# Altium schematic sheet GC-Sch2.SchDoc (part 2 of 3)
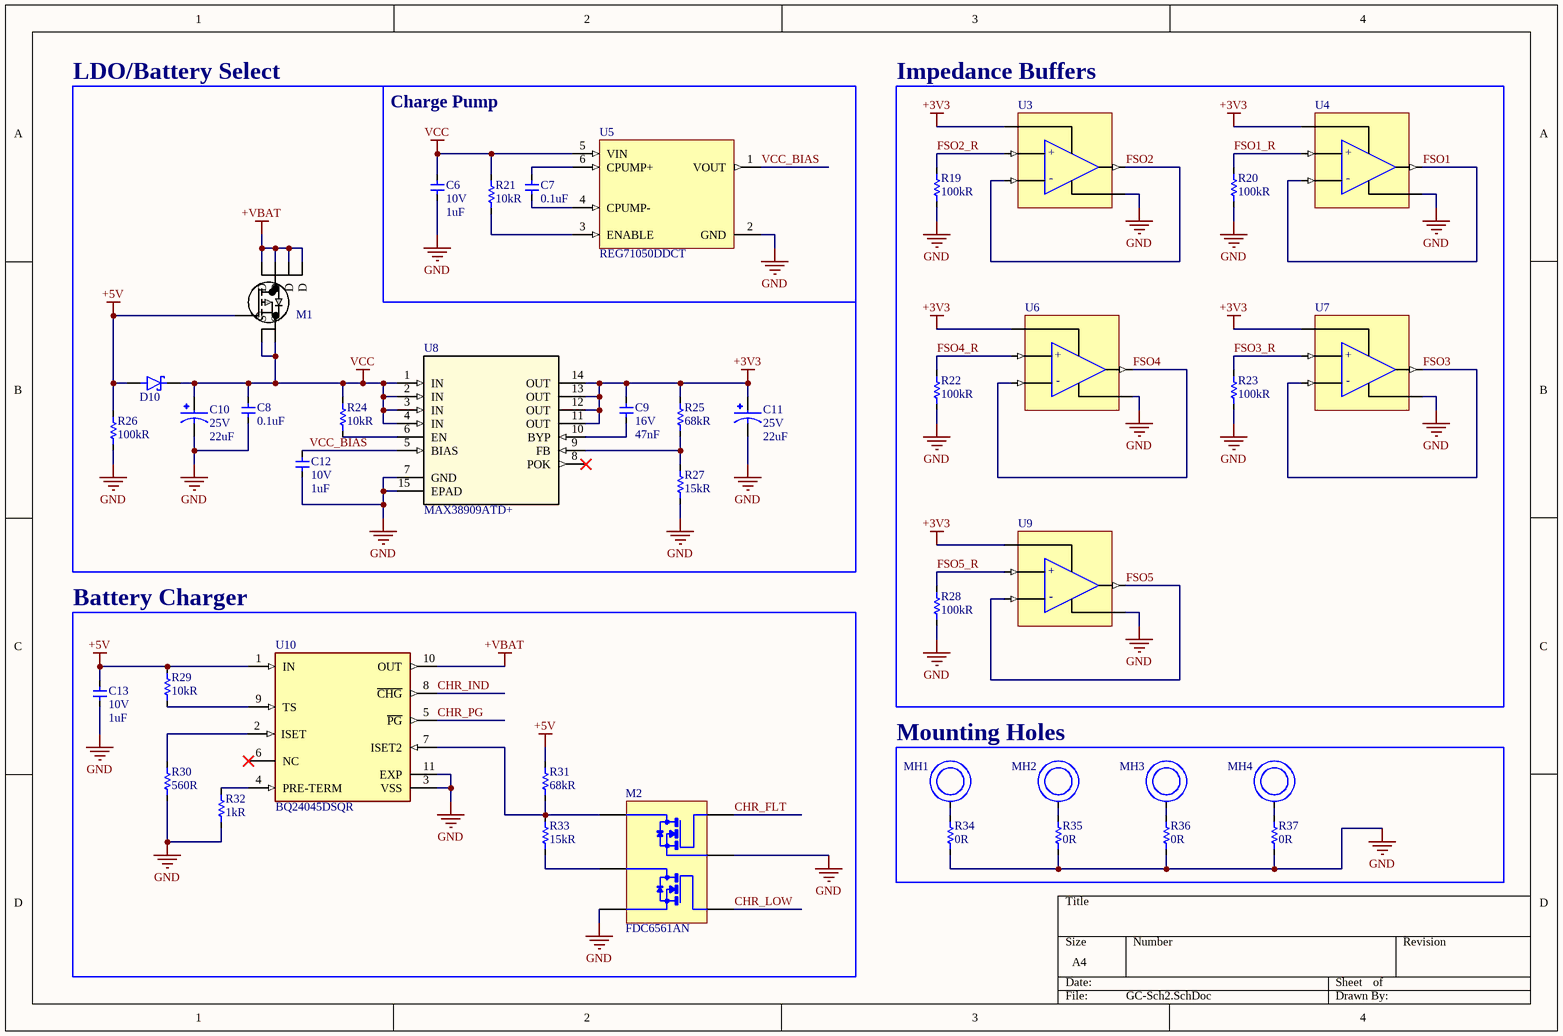
[diagram p1: GC-Sch2.SchDoc]
## Library data of the parts
C6 C13 = CC-CL10B105KP8NNNC: Ceramic Capacitor, Multilayer, Ceramic, 10V, 10% +Tol, 10% -Tol, X7R, 15% TC, 1uF, Surface Mount, 0603; Manufacturer: Samsung; Multilayer: Yes; Supplier 1: Avnet; Supplier Part Number 1: CL10B105KP8NNNC; Manufacturer Part Number: CL10B105KP8NNNC; RoHS: Yes; Category: Ceramic Capacitors; Stock: 168000; Pricing: 4000=0.00532, 8000=0.0052, 16000=0.00508, 24000=0.00496, 32000=0.00484 (USD); Mount: Surface Mount; Number of Pins: 2; Dielectric Material: Ceramic; Package Shape: Rectangular; Size Code: 0603; Terminal Finish: Nickel; Min Operating Temperature: -55°C; Max Operating Temperature: 125°C; Termination: Wraparound; JESD-609 Code: e3; Capacitor Type: Ceramic; Negative Tolerance: 10%; Package Style: SMTMeter; Packaging: Tape and Reel; Positive Tolerance: 10%; Temperature Characteristics Code: X7R; Length: 1.6mm; Width: 0.8mm; Height: 0.9mm; Reach SVHC Compliant: Yes; RoHS Compliant: Yes; ComponentLink1URL: https://datasheet.ciiva.com:443/pdfs/VipMasterIC/IC/SEMS/SEMS-S-A0008526420/SEMS-S-A0008526450-1.pdf?src-supplier=IHS+Markit; ComponentLink1Description: https://datasheet.ciiva.com:443/pdfs/VipMasterIC/IC/SEMS/SEMS-S-A0008526420/SEMS-S-A0008526450-1.pdf?src-supplier=IHS+Markit; ComponentLink2URL: https://datasheet.ciiva.com/25788/cl10b105kp8nnnc-25788304.pdf?src-supplier=Digikey; ComponentLink2Description: https://datasheet.ciiva.com/25788/cl10b105kp8nnnc-25788304.pdf?src-supplier=Digikey; ComponentLink3URL: https://datasheet.ciiva.com/16396/cl10b105kp8nnnc-16396970.pdf?src-supplier=Future+Electronics; ComponentLink3Description: https://datasheet.ciiva.com/16396/cl10b105kp8nnnc-16396970.pdf?src-supplier=Future+Electronics; ComponentLink4URL: https://datasheet.ciiva.com/26838/getdatasheetpartid-358410-26838426.pdf?src-supplier=Verical; ComponentLink4Description: https://datasheet.ciiva.com/26838/getdatasheetpartid-358410-26838426.pdf?src-supplier=Verical
C7 = CC-CL10B104JB8NNNC: Ceramic Capacitor, Multilayer, Ceramic, 50V, 5% +Tol, 5% -Tol, X7R, 15% TC, 0.1uF, Surface Mount, 0603; Manufacturer: Samsung; Multilayer: Yes; Supplier 1: Avnet; Supplier Part Number 1: CL10B104JB8NNNC; Manufacturer Part Number: CL10B104JB8NNNC; RoHS: Yes; Category: Ceramic Capacitors; Stock: 4000; Pricing: 4000=0.00545, 8000=0.00532, 16000=0.0052, 24000=0.00507, 32000=0.00495 (USD); Mount: Surface Mount; Number of Pins: 2; Dielectric Material: Ceramic; Package Shape: Rectangular; Size Code: 0603; Terminal Finish: Nickel; Min Operating Temperature: -55°C; Max Operating Temperature: 125°C; JESD-609 Code: e3; Capacitor Type: Ceramic; Negative Tolerance: 5%; Package Style: SMTMeter; Packaging: Tape and Reel; Positive Tolerance: 5%; Rated DC Voltage (URdc): 50V; Temperature Characteristics Code: X7R; Termination: Wraparound; Length: 1.6mm; Width: 0.8mm; Height: 0.8mm; Reach SVHC Compliant: Yes; RoHS Compliant: Yes; ComponentLink1URL: https://datasheet.ciiva.com:443/pdfs/VipMasterIC/IC/SEMS/SEMS-S-A0008384515/SEMS-S-A0008873313-1.pdf?src-supplier=IHS+Markit; ComponentLink1Description: https://datasheet.ciiva.com:443/pdfs/VipMasterIC/IC/SEMS/SEMS-S-A0008384515/SEMS-S-A0008873313-1.pdf?src-supplier=IHS+Markit; ComponentLink2URL: https://datasheet.ciiva.com/16498/cl10b104jb8nnnc-16498485.pdf?src-supplier=Future+Electronics; ComponentLink2Description: https://datasheet.ciiva.com/16498/cl10b104jb8nnnc-16498485.pdf?src-supplier=Future+Electronics; ComponentLink3URL: https://datasheet.ciiva.com/26838/getdatasheetpartid-359321-26838402.pdf?src-supplier=Verical; ComponentLink3Description: https://datasheet.ciiva.com/26838/getdatasheetpartid-359321-26838402.pdf?src-supplier=Verical; ComponentLink4URL: https://datasheet.ciiva.com/25793/cl10b104jb8nnnc-25793394.pdf?src-supplier=Digikey; ComponentLink4Description: https://datasheet.ciiva.com/25793/cl10b104jb8nnnc-25793394.pdf?src-supplier=Digikey; ComponentLink5URL: https://datasheet.ciiva.com/29199/456613-da-01-en-vs-kondensator-0603-29199008.pdf?src-supplier=Conrad; ComponentLink5Description: https://datasheet.ciiva.com/29199/456613-da-01-en-vs-kondensator-0603-29199008.pdf?src-supplier=Conrad
C8 = C-CL10B104JB8NNNC: Ceramic Capacitor, Multilayer, Ceramic, 50V, 5% +Tol, 5% -Tol, X7R, 15% TC, 0.1uF, Surface Mount, 0603; Manufacturer: Samsung; Multilayer: Yes; Supplier 1: Avnet; Supplier Part Number 1: CL10B104JB8NNNC; Manufacturer Part Number: CL10B104JB8NNNC; RoHS: Yes; Category: Ceramic Capacitors; Stock: 4000; Pricing: 4000=0.00545, 8000=0.00532, 16000=0.0052, 24000=0.00507, 32000=0.00495 (USD); Mount: Surface Mount; Number of Pins: 2; Dielectric Material: Ceramic; Package Shape: Rectangular; Size Code: 0603; Terminal Finish: Nickel; Min Operating Temperature: -55°C; Max Operating Temperature: 125°C; JESD-609 Code: e3; Capacitor Type: Ceramic; Negative Tolerance: 5%; Package Style: SMTMeter; Packaging: Tape and Reel; Positive Tolerance: 5%; Rated DC Voltage (URdc): 50V; Temperature Characteristics Code: X7R; Termination: Wraparound; Length: 1.6mm; Width: 0.8mm; Height: 0.8mm; Reach SVHC Compliant: Yes; RoHS Compliant: Yes; ComponentLink1URL: https://datasheet.ciiva.com:443/pdfs/VipMasterIC/IC/SEMS/SEMS-S-A0008384515/SEMS-S-A0008873313-1.pdf?src-supplier=IHS+Markit; ComponentLink1Description: https://datasheet.ciiva.com:443/pdfs/VipMasterIC/IC/SEMS/SEMS-S-A0008384515/SEMS-S-A0008873313-1.pdf?src-supplier=IHS+Markit; ComponentLink2URL: https://datasheet.ciiva.com/16498/cl10b104jb8nnnc-16498485.pdf?src-supplier=Future+Electronics; ComponentLink2Description: https://datasheet.ciiva.com/16498/cl10b104jb8nnnc-16498485.pdf?src-supplier=Future+Electronics; ComponentLink3URL: https://datasheet.ciiva.com/26838/getdatasheetpartid-359321-26838402.pdf?src-supplier=Verical; ComponentLink3Description: https://datasheet.ciiva.com/26838/getdatasheetpartid-359321-26838402.pdf?src-supplier=Verical; ComponentLink4URL: https://datasheet.ciiva.com/25793/cl10b104jb8nnnc-25793394.pdf?src-supplier=Digikey; ComponentLink4Description: https://datasheet.ciiva.com/25793/cl10b104jb8nnnc-25793394.pdf?src-supplier=Digikey; ComponentLink5URL: https://datasheet.ciiva.com/29199/456613-da-01-en-vs-kondensator-0603-29199008.pdf?src-supplier=Conrad; ComponentLink5Description: https://datasheet.ciiva.com/29199/456613-da-01-en-vs-kondensator-0603-29199008.pdf?src-supplier=Conrad
C9 = CC-CL10B473KO8NNNC: Ceramic Capacitor, Multilayer, Ceramic, 16V, 10% +Tol, 10% -Tol, X7R, 15% TC, 0.047uF, Surface Mount, 0603; Manufacturer: Samsung; Multilayer: Yes; Supplier 1: Avnet; Supplier Part Number 1: CL10B473KO8NNNC; Manufacturer Part Number: CL10B473KO8NNNC; RoHS: Yes; Category: Ceramic Capacitors; Stock: 4000; Pricing: 4000=0.00536, 8000=0.00524, 16000=0.00511, 24000=0.00499, 32000=0.00487 (USD); Mount: Surface Mount; Number of Pins: 2; Dielectric Material: Ceramic; Package Shape: Rectangular; Size Code: 0603; Terminal Finish: Nickel; Min Operating Temperature: -55°C; Max Operating Temperature: 125°C; JESD-609 Code: e3; Capacitor Type: Ceramic; Negative Tolerance: 10%; Packaging: Tape and Reel; Positive Tolerance: 10%; Temperature Characteristics Code: X7R; Termination: Wraparound; Package Style: SMTMeter; Length: 1.6mm; Width: 0.8mm; Height: 0.8mm; Reach SVHC Compliant: Yes; RoHS Compliant: Yes; ComponentLink1URL: https://datasheet.ciiva.com:443/pdfs/VipMasterIC/IC/SEMS/SEMS-S-A0008521219/SEMS-S-A0008521235-1.pdf?src-supplier=IHS+Markit; ComponentLink1Description: https://datasheet.ciiva.com:443/pdfs/VipMasterIC/IC/SEMS/SEMS-S-A0008521219/SEMS-S-A0008521235-1.pdf?src-supplier=IHS+Markit; ComponentLink2URL: https://datasheet.ciiva.com/15195/getdatasheetpartid-354053-15195766.pdf?src-supplier=Verical; ComponentLink2Description: https://datasheet.ciiva.com/15195/getdatasheetpartid-354053-15195766.pdf?src-supplier=Verical
C10 = C-EEE-FP1E220AR: Aluminum Electrolytic Capacitor, Polarized, Aluminum (wet), 25V, 20% +Tol, 20% -Tol, 22uF, Surface Mount, 2121; Manufacturer: Panasonic; Manufacturer Series: FP; Dielectric Material: Aluminium; ESR (Equivalent Series Resistance): 360mR; Leakage Current: 5.5uA; Ripple Current: 240mA; Tan Delta: 0.14; Supplier 1: Mouser; Supplier Part Number 1: 667-EEE-FP1E220AR; Manufacturer Part Number: EEE-FP1E220AR; RoHS: Yes; Category: Aluminum Electrolytic Capacitors; Stock: 28900; Pricing: 1=0.5, 10=0.271, 50=0.271, 100=0.175, 1000=0.134, 10000=0.114 (USD); Mount: Surface Mount; Number of Pins: 2; Package Shape: Cylindrical; Size Code: 2121; Terminal Finish: Tin; Min Operating Temperature: -55°C; Max Operating Temperature: 105°C; JESD-609 Code: e3,e6; Polarity: Polarized; Capacitor Type: Aluminium; Negative Tolerance: 20%; Package Style: SMTMeter; Packaging: Tape and Reel; Positive Tolerance: 20%; Series: EEE-FP(LF REFLOW); Termination: Flat; Length: 6.5mm; Width: 5.3mm; Height: 5.8mm; Reach SVHC Compliant: Yes; RoHS Compliant: Yes; ComponentLink1URL: https://datasheet.ciiva.com:443/pdfs/VipMasterIC/IC/PANA/PANA-S-A0009615249/PANA-S-A0009615249-1.pdf?src-supplier=IHS+Markit; ComponentLink1Description: https://datasheet.ciiva.com:443/pdfs/VipMasterIC/IC/PANA/PANA-S-A0009615249/PANA-S-A0009615249-1.pdf?src-supplier=IHS+Markit; ComponentLink2URL: https://datasheet.ciiva.com/48523/fp-eng-tds-48523749.pdf?src-supplier=Distrelec; ComponentLink2Description: https://datasheet.ciiva.com/48523/fp-eng-tds-48523749.pdf?src-supplier=Distrelec; ComponentLink3URL: https://datasheet.ciiva.com/16390/aba0000ce114-16390486.pdf?src-supplier=Future+Electronics; ComponentLink3Description: https://datasheet.ciiva.com/16390/aba0000ce114-16390486.pdf?src-supplier=Future+Electronics; ComponentLink4URL: https://datasheet.ciiva.com/15166/getdatasheetpartid-178535-15166251.pdf?src-supplier=Verical; ComponentLink4Description: https://datasheet.ciiva.com/15166/getdatasheetpartid-178535-15166251.pdf?src-supplier=Verical
C11 = CC-EEE-FP1E220AR: Aluminum Electrolytic Capacitor, Polarized, Aluminum (wet), 25V, 20% +Tol, 20% -Tol, 22uF, Surface Mount, 2121; Manufacturer: Panasonic; Manufacturer Series: FP; Dielectric Material: Aluminium; ESR (Equivalent Series Resistance): 360mR; Leakage Current: 5.5uA; Ripple Current: 240mA; Tan Delta: 0.14; Supplier 1: Mouser; Supplier Part Number 1: 667-EEE-FP1E220AR; Manufacturer Part Number: EEE-FP1E220AR; RoHS: Yes; Category: Aluminum Electrolytic Capacitors; Stock: 28900; Pricing: 1=0.5, 10=0.271, 50=0.271, 100=0.175, 1000=0.134, 10000=0.114 (USD); Mount: Surface Mount; Number of Pins: 2; Package Shape: Cylindrical; Size Code: 2121; Terminal Finish: Tin; Min Operating Temperature: -55°C; Max Operating Temperature: 105°C; JESD-609 Code: e3,e6; Polarity: Polarized; Capacitor Type: Aluminium; Negative Tolerance: 20%; Package Style: SMTMeter; Packaging: Tape and Reel; Positive Tolerance: 20%; Series: EEE-FP(LF REFLOW); Termination: Flat; Length: 6.5mm; Width: 5.3mm; Height: 5.8mm; Reach SVHC Compliant: Yes; RoHS Compliant: Yes; ComponentLink1URL: https://datasheet.ciiva.com:443/pdfs/VipMasterIC/IC/PANA/PANA-S-A0009615249/PANA-S-A0009615249-1.pdf?src-supplier=IHS+Markit; ComponentLink1Description: https://datasheet.ciiva.com:443/pdfs/VipMasterIC/IC/PANA/PANA-S-A0009615249/PANA-S-A0009615249-1.pdf?src-supplier=IHS+Markit; ComponentLink2URL: https://datasheet.ciiva.com/48523/fp-eng-tds-48523749.pdf?src-supplier=Distrelec; ComponentLink2Description: https://datasheet.ciiva.com/48523/fp-eng-tds-48523749.pdf?src-supplier=Distrelec; ComponentLink3URL: https://datasheet.ciiva.com/16390/aba0000ce114-16390486.pdf?src-supplier=Future+Electronics; ComponentLink3Description: https://datasheet.ciiva.com/16390/aba0000ce114-16390486.pdf?src-supplier=Future+Electronics; ComponentLink4URL: https://datasheet.ciiva.com/15166/getdatasheetpartid-178535-15166251.pdf?src-supplier=Verical; ComponentLink4Description: https://datasheet.ciiva.com/15166/getdatasheetpartid-178535-15166251.pdf?src-supplier=Verical
C12 = C-CL10B105KP8NNNC: Ceramic Capacitor, Multilayer, Ceramic, 10V, 10% +Tol, 10% -Tol, X7R, 15% TC, 1uF, Surface Mount, 0603; Manufacturer: Samsung; Multilayer: Yes; Supplier 1: Avnet; Supplier Part Number 1: CL10B105KP8NNNC; Manufacturer Part Number: CL10B105KP8NNNC; RoHS: Yes; Category: Ceramic Capacitors; Stock: 168000; Pricing: 4000=0.00532, 8000=0.0052, 16000=0.00508, 24000=0.00496, 32000=0.00484 (USD); Mount: Surface Mount; Number of Pins: 2; Dielectric Material: Ceramic; Package Shape: Rectangular; Size Code: 0603; Terminal Finish: Nickel; Min Operating Temperature: -55°C; Max Operating Temperature: 125°C; Termination: Wraparound; JESD-609 Code: e3; Capacitor Type: Ceramic; Negative Tolerance: 10%; Package Style: SMTMeter; Packaging: Tape and Reel; Positive Tolerance: 10%; Temperature Characteristics Code: X7R; Length: 1.6mm; Width: 0.8mm; Height: 0.9mm; Reach SVHC Compliant: Yes; RoHS Compliant: Yes; ComponentLink1URL: https://datasheet.ciiva.com:443/pdfs/VipMasterIC/IC/SEMS/SEMS-S-A0008526420/SEMS-S-A0008526450-1.pdf?src-supplier=IHS+Markit; ComponentLink1Description: https://datasheet.ciiva.com:443/pdfs/VipMasterIC/IC/SEMS/SEMS-S-A0008526420/SEMS-S-A0008526450-1.pdf?src-supplier=IHS+Markit; ComponentLink2URL: https://datasheet.ciiva.com/25788/cl10b105kp8nnnc-25788304.pdf?src-supplier=Digikey; ComponentLink2Description: https://datasheet.ciiva.com/25788/cl10b105kp8nnnc-25788304.pdf?src-supplier=Digikey; ComponentLink3URL: https://datasheet.ciiva.com/16396/cl10b105kp8nnnc-16396970.pdf?src-supplier=Future+Electronics; ComponentLink3Description: https://datasheet.ciiva.com/16396/cl10b105kp8nnnc-16396970.pdf?src-supplier=Future+Electronics; ComponentLink4URL: https://datasheet.ciiva.com/26838/getdatasheetpartid-358410-26838426.pdf?src-supplier=Verical; ComponentLink4Description: https://datasheet.ciiva.com/26838/getdatasheetpartid-358410-26838426.pdf?src-supplier=Verical
D10 = D-BAT760-7: Rectifier Diode, Schottky, 1 Phase, 1 Element, 1A, 30V V(RRM), Silicon; Manufacturer: Diodes; Package Body Material: Plastic; Additional Feature: HIGH RELIABILITY; Forward Voltage-Max (VF): 270mV; Non-rep Pk Forward Current-Max: 5.5A; Number of Elements: 1; Max Power Dissipation: 235mW; Time @ Peak Reflow Temperature-Max (s): 40s; Qualification Status: Not Qualified; Supplier 1: Future Electronics; Supplier Part Number 1: 4017860; Manufacturer Part Number: BAT760-7; RoHS: Yes; Category: Rectifier Diodes; Stock: 81000; Pricing: 3000=0.0527, 9000=0.0507, 15000=0.0498, 45000=0.048, 75000=0.0464 (USD); Number of Pins: 2; Package Shape: Rectangular; Diode Element Material: SILICON; Terminal Finish: Tin; Min Operating Temperature: -65°C; Max Operating Temperature: 125°C; JESD-30 Code: R-PDSO-G2; Package Style: SMALL OUTLINEMeter; Surface Mount: Yes; Technology: SCHOTTKY; Terminal Form: Gull Wing; Terminal Position: DUAL; JESD-609 Code: e3; Diode Type: RECTIFIER; Moisture Sensitivity Level: 1; Max Output Current: 1A; Peak Reflow Temperature (Cel): 260°C; Rep Pk Reverse Voltage-Max: 30V; Reach SVHC Compliant: Yes; RoHS Compliant: Yes; ComponentLink1URL: https://datasheet.ciiva.com:443/pdfs/VipMasterIC/IC/DIOD/DIOD-S-A0004140720/DIOD-S-A0004140720-1.pdf?src-supplier=IHS+Markit; ComponentLink1Description: https://datasheet.ciiva.com:443/pdfs/VipMasterIC/IC/DIOD/DIOD-S-A0004140720/DIOD-S-A0004140720-1.pdf?src-supplier=IHS+Markit; ComponentLink2URL: https://datasheet.ciiva.com/1178/ds30498-1178033.pdf?src-supplier=Element14; ComponentLink2Description: https://datasheet.ciiva.com/1178/ds30498-1178033.pdf?src-supplier=Element14; ComponentLink3URL: https://datasheet.ciiva.com/4715/ds30498-63155-4715521.pdf?src-supplier=Mouser; ComponentLink3Description: https://datasheet.ciiva.com/4715/ds30498-63155-4715521.pdf?src-supplier=Mouser; ComponentLink4URL: https://datasheet.ciiva.com/8301/ds30498-8301400.pdf?src-supplier=Avnet; ComponentLink4Description: https://datasheet.ciiva.com/8301/ds30498-8301400.pdf?src-supplier=Avnet; ComponentLink5URL: https://datasheet.ciiva.com/22695/1670989-22695799.pdf?src-supplier=Element14; ComponentLink5Description: https://datasheet.ciiva.com/22695/1670989-22695799.pdf?src-supplier=Element14; ComponentLink6URL: https://datasheet.ciiva.com/914/ds30498-914552.pdf?src-supplier=Digikey; ComponentLink6Description: https://datasheet.ciiva.com/914/ds30498-914552.pdf?src-supplier=Digikey; ComponentLink7URL: https://datasheet.ciiva.com/914/ds30498-914553.pdf?src-supplier=Digikey; ComponentLink7Description: https://datasheet.ciiva.com/914/ds30498-914553.pdf?src-supplier=Digikey; ComponentLink8URL: https://datasheet.ciiva.com/914/ds30498-914551.pdf?src-supplier=Digikey; ComponentLink8Description: https://datasheet.ciiva.com/914/ds30498-914551.pdf?src-supplier=Digikey
M1 = M-SIA427ADJ-T1-GE3: Power Field-Effect Transistor, 12A I(D), 8V, 0.016ohm, 1-Element, P-Channel, Silicon, Metal-oxide Semiconductor FET; Manufacturer: Vishay Siliconix; Power Dissipation-Max (Abs): 19W; Supplier 1: Mouser; Supplier Part Number 1: 78-SIA427ADJ-T1-GE3; Manufacturer Part Number: SIA427ADJ-T1-GE3; RoHS: Yes; Category: MOSFETs; Stock: 63429; Pricing: 1=0.53, 10=0.455, 50=0.455, 100=0.34, 1000=0.207, 10000=0.158 (USD); Terminal Finish: Tin; Max Operating Temperature: 150°C; JESD-609 Code: e3; Polarity/Channel Type: P-CHANNEL; Drain Current-Max (Abs) (ID): 12A; FET Technology: METAL-OXIDE SEMICONDUCTOR; Surface Mount: Yes; Reach SVHC Compliant: Yes; RoHS Compliant: Yes; ComponentLink1URL: https://datasheet.ciiva.com:443/pdfs/VipMasterIC/IC/VISH/VISH-S-A0001142626/VISH-S-A0001142626-1.pdf?src-supplier=IHS+Markit; ComponentLink1Description: https://datasheet.ciiva.com:443/pdfs/VipMasterIC/IC/VISH/VISH-S-A0001142626/VISH-S-A0001142626-1.pdf?src-supplier=IHS+Markit; ComponentLink2URL: http://www.farnell.com/datasheets/2614535.pdf?src-supplier=Farnell; ComponentLink2Description: http://www.farnell.com/datasheets/2614535.pdf?src-supplier=Farnell; ComponentLink3URL: http://www.mouser.com/ds/2/427/sia427adj-537173.pdf?src-supplier=Mouser; ComponentLink3Description: http://www.mouser.com/ds/2/427/sia427adj-537173.pdf?src-supplier=Mouser; ComponentLink4URL: http://www.vishay.com/docs/63651/sia427adj.pdf?src-supplier=Digikey; ComponentLink4Description: http://www.vishay.com/docs/63651/sia427adj.pdf?src-supplier=Digikey; ComponentLink5URL: http://www.vishay.com/docs/63651/sia427adj.pdf?src-supplier=Avnet; ComponentLink5Description: http://www.vishay.com/docs/63651/sia427adj.pdf?src-supplier=Avnet; ComponentLink6URL: http://www.farnell.com/datasheets/2614535.pdf?src-supplier=Element14; ComponentLink6Description: http://www.farnell.com/datasheets/2614535.pdf?src-supplier=Element14; ComponentLink7URL: http://www.farnell.com/datasheets/2614535.pdf?src-supplier=Newark; ComponentLink7Description: http://www.farnell.com/datasheets/2614535.pdf?src-supplier=Newark
M2 = M-FDC6561AN: Small Signal Field-Effect Transistor, 2.5A I(D), 30V, 2-Element, N-Channel, Silicon, Metal-oxide Semiconductor FET; Manufacturer: ON Semiconductor / Fairchild; Package Body Material: Plastic; Drain-source On Resistance-Max: 95mR; Number of Elements: 2; Operating Mode: ENHANCEMENT MODE; Power Dissipation-Max (Abs): 960mW; Transistor Application: SWITCHING; Qualification Status: Not Qualified; Supplier 1: Future Electronics; Supplier Part Number 1: 1119379; Manufacturer Part Number: FDC6561AN; RoHS: Yes; Category: MOSFETs; Stock: 60000; Pricing: 3000=0.215, 6000=0.21, 9000=0.205, 12000=0.205, 15000=0.2 (USD); Number of Pins: 6; Package Shape: Rectangular; Transistor Element Material: SILICON; Max Operating Temperature: 150°C; Package Style: SMALL OUTLINEMeter; Surface Mount: Yes; Polarity/Channel Type: N-CHANNEL; Drain Current-Max (ID): 2.5A; DS Breakdown Voltage-Min: 30V; FET Technology: METAL-OXIDE SEMICONDUCTOR; JESD-30 Code: R-PDSO-G6; Moisture Sensitivity Level: 1; Terminal Form: Gull Wing; Terminal Position: DUAL; Drain Current-Max (Abs) (ID): 2.5A; Reach SVHC Compliant: Yes; RoHS Compliant: Yes; ComponentLink1URL: https://datasheet.ciiva.com:443/pdfs/VipMasterIC/IC/ONSM/ONSM-S-A0003579719/ONSM-S-A0003579719-1.pdf?src-supplier=IHS+Markit; ComponentLink1Description: https://datasheet.ciiva.com:443/pdfs/VipMasterIC/IC/ONSM/ONSM-S-A0003579719/ONSM-S-A0003579719-1.pdf?src-supplier=IHS+Markit; ComponentLink2URL: https://datasheet.ciiva.com/1252/11844-1252600.pdf?src-supplier=Newark; ComponentLink2Description: https://datasheet.ciiva.com/1252/11844-1252600.pdf?src-supplier=Newark; ComponentLink3URL: https://datasheet.ciiva.com/928/fdc6561an-928038.pdf?src-supplier=Digikey; ComponentLink3Description: https://datasheet.ciiva.com/928/fdc6561an-928038.pdf?src-supplier=Digikey; ComponentLink4URL: https://datasheet.ciiva.com/928/fdc6561an-928039.pdf?src-supplier=Digikey; ComponentLink4Description: https://datasheet.ciiva.com/928/fdc6561an-928039.pdf?src-supplier=Digikey; ComponentLink5URL: https://datasheet.ciiva.com/928/fdc6561an-928040.pdf?src-supplier=Digikey; ComponentLink5Description: https://datasheet.ciiva.com/928/fdc6561an-928040.pdf?src-supplier=Digikey; ComponentLink6URL: https://datasheet.ciiva.com/8114/fdc6561an-8114955.pdf?src-supplier=Avnet; ComponentLink6Description: https://datasheet.ciiva.com/8114/fdc6561an-8114955.pdf?src-supplier=Avnet; ComponentLink7URL: https://datasheet.ciiva.com/22655/11844-22655279.pdf?src-supplier=Element14; ComponentLink7Description: https://datasheet.ciiva.com/22655/11844-22655279.pdf?src-supplier=Element14; ComponentLink8URL: https://datasheet.ciiva.com/22681/11844-22681868.pdf?src-supplier=Element14; ComponentLink8Description: https://datasheet.ciiva.com/22681/11844-22681868.pdf?src-supplier=Element14; ComponentLink9URL: https://datasheet.ciiva.com/22681/11844-22681869.pdf?src-supplier=Element14; ComponentLink9Description: https://datasheet.ciiva.com/22681/11844-22681869.pdf?src-supplier=Element14
R19 R20 R22 R23 R26 R28 = R-RC0603FR-07100KL: Fixed Resistor, Metal Glaze/thick Film, 0.1W, 100000ohm, 75V, 1% +/-Tol, 100ppm/Cel, Surface Mount, 0603; Manufacturer: Yageo; Additional Feature: LASER TRIMMABLE; Rated Power Dissipation (P): 100mW; Rated Temperature: 70°C; Temperature Coefficient: 100ppm/°C; Package Height: 0.45mm; Package Length: 1.6mm; Package Width: 0.8mm; Supplier 1: Future Electronics; Supplier Part Number 1: 3697448; Manufacturer Part Number: RC0603FR-07100KL; RoHS: Yes; Category: Chip SMD Resistors; Stock: 10630000; Pricing: 5000=0.0015, 75000=0.0015, 250000=0.0014, 750000=0.0013, 2500000=0.0012 (USD); Mount: Surface Mount; Number of Pins: 2; Package Shape: Rectangular; Size Code: 0603; Terminal Finish: Nickel; Min Operating Temperature: -55°C; Max Operating Temperature: 155°C; Tolerance: 1%; JESD-609 Code: e3; Resistor Type: FIXED RESISTOR; Construction: Chip; Package Style: SMTMeter; Packaging: Tape and Reel; Technology: METAL GLAZE/THICK FILM; Termination: Wraparound; Working Voltage: 75V; Reach SVHC Compliant: Yes; RoHS Compliant: Yes; ComponentLink1URL: https://datasheet.ciiva.com:443/pdfs/VipMasterIC/IC/YAGO/YAGO-S-A0008145938/YAGO-S-A0008145938-1.pdf?src-supplier=IHS+Markit; ComponentLink1Description: https://datasheet.ciiva.com:443/pdfs/VipMasterIC/IC/YAGO/YAGO-S-A0008145938/YAGO-S-A0008145938-1.pdf?src-supplier=IHS+Markit; ComponentLink2URL: https://datasheet.ciiva.com/11808/0900766b80f96399-11808107.pdf?src-supplier=Rs; ComponentLink2Description: https://datasheet.ciiva.com/11808/0900766b80f96399-11808107.pdf?src-supplier=Rs; ComponentLink3URL: https://datasheet.ciiva.com/7983/443971-7983593.pdf?src-supplier=Element14; ComponentLink3Description: https://datasheet.ciiva.com/7983/443971-7983593.pdf?src-supplier=Element14; ComponentLink4URL: https://datasheet.ciiva.com/22747/443971-22747516.pdf?src-supplier=Element14; ComponentLink4Description: https://datasheet.ciiva.com/22747/443971-22747516.pdf?src-supplier=Element14; ComponentLink5URL: https://datasheet.ciiva.com/46440/1868787-46440889.pdf?src-supplier=Element14; ComponentLink5Description: https://datasheet.ciiva.com/46440/1868787-46440889.pdf?src-supplier=Element14; ComponentLink6URL: https://datasheet.ciiva.com/7746/1738695-7746235.pdf?src-supplier=Element14; ComponentLink6Description: https://datasheet.ciiva.com/7746/1738695-7746235.pdf?src-supplier=Element14; ComponentLink7URL: https://datasheet.ciiva.com/7746/1738695-7746234.pdf?src-supplier=Element14; ComponentLink7Description: https://datasheet.ciiva.com/7746/1738695-7746234.pdf?src-supplier=Element14
R21 R24 R29 = R-AC0603FR-1310KL: Fixed Resistor, Metal Glaze/thick Film, 0.1W, 10000ohm, 75V, 1% +/-Tol, 100ppm/Cel, Surface Mount, 0603; Manufacturer: Yageo; Additional Feature: LASER TRIMMABLE; Rated Power Dissipation (P): 100mW; Rated Temperature: 70°C; Temperature Coefficient: 100ppm/°C; Package Height: 0.45mm; Package Length: 1.6mm; Package Width: 0.8mm; Reference Standard: AEC-Q200; Supplier 1: Avnet; Supplier Part Number 1: AC0603FR-1310KL; Manufacturer Part Number: AC0603FR-1310KL; RoHS: Yes; Category: Chip SMD Resistors; Stock: 60000; Pricing: 20000=0.00167 (USD); Mount: Surface Mount; Number of Pins: 2; Package Shape: Rectangular; Size Code: 0603; Terminal Finish: Nickel; Min Operating Temperature: -55°C; Max Operating Temperature: 155°C; Tolerance: 1%; JESD-609 Code: e3; Resistor Type: FIXED RESISTOR; Construction: Chip; Package Style: SMTMeter; Packaging: Tape and Reel; Technology: METAL GLAZE/THICK FILM; Termination: Wraparound; Working Voltage: 75V; Reach SVHC Compliant: Yes; RoHS Compliant: Yes; ComponentLink1URL: https://datasheet.ciiva.com:443/pdfs/VipMasterIC/IC/YAGO/YAGO-S-A0003597364/YAGO-S-A0003597364-1.pdf?src-supplier=IHS+Markit; ComponentLink1Description: https://datasheet.ciiva.com:443/pdfs/VipMasterIC/IC/YAGO/YAGO-S-A0003597364/YAGO-S-A0003597364-1.pdf?src-supplier=IHS+Markit; ComponentLink2URL: https://datasheet.octopart.com/AC0603FR-1310KL-Yageo-datasheet-166720450.pdf?src-supplier=Future+Electronics; ComponentLink2Description: https://datasheet.octopart.com/AC0603FR-1310KL-Yageo-datasheet-166720450.pdf?src-supplier=Future+Electronics
R25 R31 = R-ERA-3AEB683V: Fixed Resistor, Thin Film, 0.1W, 68000ohm, 75V, 0.1% +/-Tol, 25ppm/Cel, Surface Mount, 0603; Manufacturer: Panasonic; Rated Power Dissipation (P): 100mW; Rated Temperature: 85°C; Temperature Coefficient: 25ppm/°C; Package Height: 0.45mm; Package Length: 1.6mm; Package Width: 0.8mm; Reference Standard: AEC-Q200; Supplier 1: Mouser; Supplier Part Number 1: 667-ERA-3AEB683V; Manufacturer Part Number: ERA-3AEB683V; RoHS: Yes; Category: Chip SMD Resistors; Stock: 13636; Pricing: 1=0.32, 10=0.139, 50=0.139, 100=0.062, 1000=0.043, 10000=0.034 (USD); Mount: Surface Mount; Number of Pins: 2; Size Code: 0603; Terminal Finish: Nickel; Min Operating Temperature: -55°C; Max Operating Temperature: 155°C; Tolerance: 0.1%; JESD-609 Code: e3; Resistor Type: FIXED RESISTOR; Construction: Rectangular; Package Style: SMTMeter; Packaging: Tape and Reel; Technology: THIN FILM; Termination: Wraparound; Working Voltage: 75V; Reach SVHC Compliant: Yes; RoHS Compliant: Yes; ComponentLink1URL: https://datasheet.ciiva.com:443/pdfs/VipMasterIC/IC/PANA/PANA-S-A0009459258/PANA-S-A0009459258-1.pdf?src-supplier=IHS+Markit; ComponentLink1Description: https://datasheet.ciiva.com:443/pdfs/VipMasterIC/IC/PANA/PANA-S-A0009459258/PANA-S-A0009459258-1.pdf?src-supplier=IHS+Markit; ComponentLink2URL: https://datasheet.ciiva.com/11808/0900766b80fe20f7-11808073.pdf?src-supplier=Rs; ComponentLink2Description: https://datasheet.ciiva.com/11808/0900766b80fe20f7-11808073.pdf?src-supplier=Rs; ComponentLink3URL: https://datasheet.ciiva.com/29183/451591-da-01-en-widerstand-0603-era-29183858.pdf?src-supplier=Conrad; ComponentLink3Description: https://datasheet.ciiva.com/29183/451591-da-01-en-widerstand-0603-era-29183858.pdf?src-supplier=Conrad; ComponentLink4URL: https://datasheet.ciiva.com/43455/485442-43455241.pdf?src-supplier=Farnell; ComponentLink4Description: https://datasheet.ciiva.com/43455/485442-43455241.pdf?src-supplier=Farnell; ComponentLink5URL: https://datasheet.ciiva.com/46443/485442-46443725.pdf?src-supplier=Element14; ComponentLink5Description: https://datasheet.ciiva.com/46443/485442-46443725.pdf?src-supplier=Element14; ComponentLink6URL: https://datasheet.ciiva.com/6138/485442-6138684.pdf?src-supplier=Farnell; ComponentLink6Description: https://datasheet.ciiva.com/6138/485442-6138684.pdf?src-supplier=Farnell; ComponentLink7URL: https://datasheet.ciiva.com/46443/485442-46443726.pdf?src-supplier=Element14; ComponentLink7Description: https://datasheet.ciiva.com/46443/485442-46443726.pdf?src-supplier=Element14; ComponentLink8URL: https://datasheet.ciiva.com/48530/era-eng-tds-48530367.pdf?src-supplier=Distrelec; ComponentLink8Description: https://datasheet.ciiva.com/48530/era-eng-tds-48530367.pdf?src-supplier=Distrelec; ComponentLink9URL: https://datasheet.ciiva.com/48425/era-eng-tds-48425487.pdf?src-supplier=Distrelec; ComponentLink9Description: https://datasheet.ciiva.com/48425/era-eng-tds-48425487.pdf?src-supplier=Distrelec; ComponentLink10URL: https://datasheet.ciiva.com/7886/485442-7886603.pdf?src-supplier=Element14; ComponentLink10Description: https://datasheet.ciiva.com/7886/485442-7886603.pdf?src-supplier=Element14; ComponentLink11URL: https://datasheet.ciiva.com/6138/485442-6138681.pdf?src-supplier=Farnell; ComponentLink11Description: https://datasheet.ciiva.com/6138/485442-6138681.pdf?src-supplier=Farnell; ComponentLink12URL: https://datasheet.ciiva.com/22739/485442-22739292.pdf?src-supplier=Element14; ComponentLink12Description: https://datasheet.ciiva.com/22739/485442-22739292.pdf?src-supplier=Element14; ComponentLink13URL: https://datasheet.ciiva.com/16770/70068849-16770412.pdf?src-supplier=Allied+Electronics; ComponentLink13Description: https://datasheet.ciiva.com/16770/70068849-16770412.pdf?src-supplier=Allied+Electronics; ComponentLink14URL: https://datasheet.ciiva.com/9117/aoa0000ce26-9117752.pdf?src-supplier=Avnet; ComponentLink14Description: https://datasheet.ciiva.com/9117/aoa0000ce26-9117752.pdf?src-supplier=Avnet
R27 R33 = R-ERA-3AEB153V: Fixed Resistor, Thin Film, 0.1W, 15000ohm, 75V, 0.1% +/-Tol, 25ppm/Cel, Surface Mount, 0603; Manufacturer: Panasonic; Rated Power Dissipation (P): 100mW; Rated Temperature: 85°C; Temperature Coefficient: 25ppm/°C; Package Height: 0.45mm; Package Length: 1.6mm; Package Width: 0.8mm; Reference Standard: AEC-Q200; Supplier 1: Mouser; Supplier Part Number 1: 667-ERA-3AEB153V; Manufacturer Part Number: ERA-3AEB153V; RoHS: Yes; Category: Chip SMD Resistors; Stock: 131542; Pricing: 1=0.31, 10=0.139, 50=0.139, 100=0.062, 1000=0.043, 10000=0.038 (USD); Mount: Surface Mount; Number of Pins: 2; Size Code: 0603; Terminal Finish: Nickel; Min Operating Temperature: -55°C; Max Operating Temperature: 155°C; Tolerance: 0.1%; JESD-609 Code: e3; Resistor Type: FIXED RESISTOR; Construction: Rectangular; Package Style: SMTMeter; Packaging: Tape and Reel; Technology: THIN FILM; Termination: Wraparound; Working Voltage: 75V; Reach SVHC Compliant: Yes; RoHS Compliant: Yes; ComponentLink1URL: https://datasheet.ciiva.com:443/pdfs/VipMasterIC/IC/PANA/PANA-S-A0009459258/PANA-S-A0009459258-1.pdf?src-supplier=IHS+Markit; ComponentLink1Description: https://datasheet.ciiva.com:443/pdfs/VipMasterIC/IC/PANA/PANA-S-A0009459258/PANA-S-A0009459258-1.pdf?src-supplier=IHS+Markit; ComponentLink2URL: https://datasheet.ciiva.com/11808/0900766b80fe20f7-11808023.pdf?src-supplier=Rs; ComponentLink2Description: https://datasheet.ciiva.com/11808/0900766b80fe20f7-11808023.pdf?src-supplier=Rs; ComponentLink3URL: https://datasheet.ciiva.com/29183/451305-da-01-en-widerstand-0603-era-29183818.pdf?src-supplier=Conrad; ComponentLink3Description: https://datasheet.ciiva.com/29183/451305-da-01-en-widerstand-0603-era-29183818.pdf?src-supplier=Conrad; ComponentLink4URL: https://datasheet.ciiva.com/46422/485442-46422566.pdf?src-supplier=Element14; ComponentLink4Description: https://datasheet.ciiva.com/46422/485442-46422566.pdf?src-supplier=Element14; ComponentLink5URL: https://datasheet.ciiva.com/6000/485442-6000508.pdf?src-supplier=Farnell; ComponentLink5Description: https://datasheet.ciiva.com/6000/485442-6000508.pdf?src-supplier=Farnell; ComponentLink6URL: https://datasheet.ciiva.com/46422/485442-46422567.pdf?src-supplier=Element14; ComponentLink6Description: https://datasheet.ciiva.com/46422/485442-46422567.pdf?src-supplier=Element14; ComponentLink7URL: https://datasheet.ciiva.com/5734/485442-5734541.pdf?src-supplier=Farnell; ComponentLink7Description: https://datasheet.ciiva.com/5734/485442-5734541.pdf?src-supplier=Farnell; ComponentLink8URL: https://datasheet.ciiva.com/28681/485442-28681528.pdf?src-supplier=Element14; ComponentLink8Description: https://datasheet.ciiva.com/28681/485442-28681528.pdf?src-supplier=Element14; ComponentLink9URL: https://datasheet.ciiva.com/16764/70068849-16764126.pdf?src-supplier=Allied+Electronics; ComponentLink9Description: https://datasheet.ciiva.com/16764/70068849-16764126.pdf?src-supplier=Allied+Electronics; ComponentLink10URL: https://datasheet.ciiva.com/9193/aoa0000ce26-9193070.pdf?src-supplier=Avnet; ComponentLink10Description: https://datasheet.ciiva.com/9193/aoa0000ce26-9193070.pdf?src-supplier=Avnet
R30 = R-ERJ-3EKF5600V: Fixed Resistor, Metal Glaze/thick Film, 0.1W, 560ohm, 75V, 1% +/-Tol, 100ppm/Cel, Surface Mount, 0603; Manufacturer: Panasonic; Rated Power Dissipation (P): 100mW; Rated Temperature: 70°C; Temperature Coefficient: 100ppm/°C; Package Height: 0.45mm; Package Length: 1.6mm; Package Width: 0.8mm; Reference Standard: AEC-Q200; Supplier 1: Mouser; Supplier Part Number 1: 667-ERJ-3EKF5600V; Manufacturer Part Number: ERJ-3EKF5600V; RoHS: Yes; Category: Chip SMD Resistors; Stock: 63183; Pricing: 1=0.1, 10=0.024, 50=0.024, 100=0.011, 1000=0.008, 10000=0.005 (USD); Mount: Surface Mount; Number of Pins: 2; Package Shape: Rectangular; Size Code: 0603; Terminal Finish: Nickel; Min Operating Temperature: -55°C; Max Operating Temperature: 155°C; Tolerance: 1%; JESD-609 Code: e3; Resistor Type: FIXED RESISTOR; Construction: Rectangular; Package Style: SMTMeter; Packaging: Tape and Reel; Technology: METAL GLAZE/THICK FILM; Termination: Wraparound; Working Voltage: 75V; Reach SVHC Compliant: Yes; RoHS Compliant: Yes; ComponentLink1URL: https://datasheet.ciiva.com:443/pdfs/VipMasterIC/IC/PANA/PANA-S-A0009889626/PANA-S-A0009889626-1.pdf?src-supplier=IHS+Markit; ComponentLink1Description: https://datasheet.ciiva.com:443/pdfs/VipMasterIC/IC/PANA/PANA-S-A0009889626/PANA-S-A0009889626-1.pdf?src-supplier=IHS+Markit; ComponentLink2URL: https://datasheet.ciiva.com/3883/3984280s8821682n1386-3883650.pdf?src-supplier=Arrow+Electronics; ComponentLink2Description: https://datasheet.ciiva.com/3883/3984280s8821682n1386-3883650.pdf?src-supplier=Arrow+Electronics; ComponentLink3URL: https://datasheet.ciiva.com/5860/aoa0000ce2-5860665.pdf?src-supplier=Farnell; ComponentLink3Description: https://datasheet.ciiva.com/5860/aoa0000ce2-5860665.pdf?src-supplier=Farnell; ComponentLink4URL: https://datasheet.ciiva.com/7909/aoa0000ce2-7909198.pdf?src-supplier=Element14; ComponentLink4Description: https://datasheet.ciiva.com/7909/aoa0000ce2-7909198.pdf?src-supplier=Element14; ComponentLink5URL: https://datasheet.ciiva.com/46381/1678782-46381547.pdf?src-supplier=Element14; ComponentLink5Description: https://datasheet.ciiva.com/46381/1678782-46381547.pdf?src-supplier=Element14; ComponentLink6URL: https://datasheet.ciiva.com/22674/1678782-22674427.pdf?src-supplier=Element14; ComponentLink6Description: https://datasheet.ciiva.com/22674/1678782-22674427.pdf?src-supplier=Element14; ComponentLink7URL: https://datasheet.ciiva.com/22737/426256-22737578.pdf?src-supplier=Element14; ComponentLink7Description: https://datasheet.ciiva.com/22737/426256-22737578.pdf?src-supplier=Element14; ComponentLink8URL: https://datasheet.ciiva.com/28590/1678782-28590766.pdf?src-supplier=Element14; ComponentLink8Description: https://datasheet.ciiva.com/28590/1678782-28590766.pdf?src-supplier=Element14; ComponentLink9URL: https://datasheet.ciiva.com/46381/1678782-46381548.pdf?src-supplier=Element14; ComponentLink9Description: https://datasheet.ciiva.com/46381/1678782-46381548.pdf?src-supplier=Element14; ComponentLink10URL: https://datasheet.ciiva.com/24124/aoa0000ce2-24124277.pdf?src-supplier=Mouser; ComponentLink10Description: https://datasheet.ciiva.com/24124/aoa0000ce2-24124277.pdf?src-supplier=Mouser; ComponentLink11URL: https://datasheet.ciiva.com/16763/70260748-16763150.pdf?src-supplier=Allied+Electronics; ComponentLink11Description: https://datasheet.ciiva.com/16763/70260748-16763150.pdf?src-supplier=Allied+Electronics; ComponentLink12URL: https://datasheet.ciiva.com/16781/70260748-16781128.pdf?src-supplier=Allied+Electronics; ComponentLink12Description: https://datasheet.ciiva.com/16781/70260748-16781128.pdf?src-supplier=Allied+Electronics; ComponentLink13URL: https://datasheet.ciiva.com/9117/aoa0000ce2-9117192.pdf?src-supplier=Avnet; ComponentLink13Description: https://datasheet.ciiva.com/9117/aoa0000ce2-9117192.pdf?src-supplier=Avnet
R32 = R-RC0603FR-071KL: Fixed Resistor, Metal Glaze/thick Film, 0.1W, 1000ohm, 75V, 1% +/-Tol, 100ppm/Cel, Surface Mount, 0603; Manufacturer: Yageo; Additional Feature: LASER TRIMMABLE; Rated Power Dissipation (P): 100mW; Rated Temperature: 70°C; Temperature Coefficient: 100ppm/°C; Package Height: 0.45mm; Package Length: 1.6mm; Package Width: 0.8mm; Supplier 1: Future Electronics; Supplier Part Number 1: 4016291; Manufacturer Part Number: RC0603FR-071KL; RoHS: Yes; Category: Chip SMD Resistors; Stock: 4965000; Pricing: 5000=0.0015, 75000=0.0015, 250000=0.0014, 750000=0.0013, 2500000=0.0012 (USD); Mount: Surface Mount; Number of Pins: 2; Package Shape: Rectangular; Size Code: 0603; Terminal Finish: Nickel; Min Operating Temperature: -55°C; Max Operating Temperature: 155°C; Tolerance: 1%; JESD-609 Code: e3; Resistor Type: FIXED RESISTOR; Construction: Chip; Package Style: SMTMeter; Packaging: Tape and Reel; Technology: METAL GLAZE/THICK FILM; Termination: Wraparound; Working Voltage: 75V; Reach SVHC Compliant: Yes; RoHS Compliant: Yes; ComponentLink1URL: https://datasheet.ciiva.com:443/pdfs/VipMasterIC/IC/YAGO/YAGO-S-A0008145938/YAGO-S-A0008145938-1.pdf?src-supplier=IHS+Markit; ComponentLink1Description: https://datasheet.ciiva.com:443/pdfs/VipMasterIC/IC/YAGO/YAGO-S-A0008145938/YAGO-S-A0008145938-1.pdf?src-supplier=IHS+Markit; ComponentLink2URL: https://datasheet.ciiva.com/11808/0900766b80f96399-11808081.pdf?src-supplier=Rs; ComponentLink2Description: https://datasheet.ciiva.com/11808/0900766b80f96399-11808081.pdf?src-supplier=Rs; ComponentLink3URL: https://datasheet.ciiva.com/7746/1686128-7746280.pdf?src-supplier=Element14; ComponentLink3Description: https://datasheet.ciiva.com/7746/1686128-7746280.pdf?src-supplier=Element14; ComponentLink4URL: https://datasheet.ciiva.com/7660/1868787-7660790.pdf?src-supplier=Element14; ComponentLink4Description: https://datasheet.ciiva.com/7660/1868787-7660790.pdf?src-supplier=Element14; ComponentLink5URL: https://datasheet.ciiva.com/7983/443971-7983613.pdf?src-supplier=Element14; ComponentLink5Description: https://datasheet.ciiva.com/7983/443971-7983613.pdf?src-supplier=Element14; ComponentLink6URL: https://datasheet.ciiva.com/7746/1738695-7746281.pdf?src-supplier=Element14; ComponentLink6Description: https://datasheet.ciiva.com/7746/1738695-7746281.pdf?src-supplier=Element14; ComponentLink7URL: https://datasheet.ciiva.com/7746/1738695-7746279.pdf?src-supplier=Element14; ComponentLink7Description: https://datasheet.ciiva.com/7746/1738695-7746279.pdf?src-supplier=Element14; ComponentLink8URL: https://datasheet.ciiva.com/8896/pyu-rc0603-51-rohs-l-4-8896106.pdf?src-supplier=Avnet; ComponentLink8Description: https://datasheet.ciiva.com/8896/pyu-rc0603-51-rohs-l-4-8896106.pdf?src-supplier=Avnet; ComponentLink9URL: https://datasheet.ciiva.com/15189/getdatasheetpartid-404327-15189644.pdf?src-supplier=Verical; ComponentLink9Description: https://datasheet.ciiva.com/15189/getdatasheetpartid-404327-15189644.pdf?src-supplier=Verical
R34-R37 = R-ERJ-3GEY0R00V: Fixed Resistor, Metal Glaze/thick Film, 0.1W, 0ohm, Surface Mount, 0603; Manufacturer: Panasonic; Rated Power Dissipation (P): 100mW; Rated Temperature: 70°C; Package Height: 0.45mm; Package Length: 1.6mm; Package Width: 0.8mm; Reference Standard: AEC-Q200; Supplier 1: Mouser; Supplier Part Number 1: 667-ERJ-3GEY0R00V; Manufacturer Part Number: ERJ-3GEY0R00V; RoHS: Yes; Category: Chip SMD Resistors; Stock: 7345218; Pricing: 1=0.1, 10=0.021, 50=0.021, 100=0.01, 1000=0.007, 10000=0.004 (USD); Mount: Surface Mount; Number of Pins: 2; Package Shape: Rectangular; Size Code: 0603; Terminal Finish: Nickel; Min Operating Temperature: -55°C; Max Operating Temperature: 155°C; JESD-609 Code: e3; Resistor Type: FIXED RESISTOR; Construction: Rectangular; Package Style: SMTMeter; Packaging: Tape and Reel; Technology: METAL GLAZE/THICK FILM; Termination: Wraparound; Reach SVHC Compliant: Yes; RoHS Compliant: Yes; ComponentLink1URL: https://datasheet.ciiva.com:443/pdfs/VipMasterIC/IC/PANA/PANA-S-A0009459603/PANA-S-A0009459603-1.pdf?src-supplier=IHS+Markit; ComponentLink1Description: https://datasheet.ciiva.com:443/pdfs/VipMasterIC/IC/PANA/PANA-S-A0009459603/PANA-S-A0009459603-1.pdf?src-supplier=IHS+Markit; ComponentLink2URL: https://datasheet.ciiva.com/27055/1935748-27055113.pdf?src-supplier=Jameco; ComponentLink2Description: https://datasheet.ciiva.com/27055/1935748-27055113.pdf?src-supplier=Jameco; ComponentLink3URL: https://datasheet.ciiva.com/11808/0900766b80f806dd-11808207.pdf?src-supplier=Rs; ComponentLink3Description: https://datasheet.ciiva.com/11808/0900766b80f806dd-11808207.pdf?src-supplier=Rs; ComponentLink4URL: https://datasheet.ciiva.com/48532/aoa0000ce1-48532165.pdf?src-supplier=Avnet; ComponentLink4Description: https://datasheet.ciiva.com/48532/aoa0000ce1-48532165.pdf?src-supplier=Avnet; ComponentLink5URL: https://datasheet.ciiva.com/43460/1678796-43460647.pdf?src-supplier=Farnell; ComponentLink5Description: https://datasheet.ciiva.com/43460/1678796-43460647.pdf?src-supplier=Farnell; ComponentLink6URL: https://datasheet.ciiva.com/5959/1678796-5959707.pdf?src-supplier=Farnell; ComponentLink6Description: https://datasheet.ciiva.com/5959/1678796-5959707.pdf?src-supplier=Farnell; ComponentLink7URL: https://datasheet.ciiva.com/46377/1678796-46377868.pdf?src-supplier=Element14; ComponentLink7Description: https://datasheet.ciiva.com/46377/1678796-46377868.pdf?src-supplier=Element14; ComponentLink8URL: https://datasheet.ciiva.com/28695/1678796-28695833.pdf?src-supplier=Element14; ComponentLink8Description: https://datasheet.ciiva.com/28695/1678796-28695833.pdf?src-supplier=Element14; ComponentLink9URL: https://datasheet.ciiva.com/16758/70255313-16758527.pdf?src-supplier=Allied+Electronics; ComponentLink9Description: https://datasheet.ciiva.com/16758/70255313-16758527.pdf?src-supplier=Allied+Electronics; ComponentLink10URL: https://datasheet.ciiva.com/9198/aoa0000ce1-9198975.pdf?src-supplier=Avnet; ComponentLink10Description: https://datasheet.ciiva.com/9198/aoa0000ce1-9198975.pdf?src-supplier=Avnet; ComponentLink11URL: https://datasheet.ciiva.com/16834/aoa0000ce1-16834828.pdf?src-supplier=Future+Electronics; ComponentLink11Description: https://datasheet.ciiva.com/16834/aoa0000ce1-16834828.pdf?src-supplier=Future+Electronics; ComponentLink12URL: https://datasheet.ciiva.com/30199/4aoa0000ce1-30199822.pdf?src-supplier=Onlinecomponents.com; ComponentLink12Description: https://datasheet.ciiva.com/30199/4aoa0000ce1-30199822.pdf?src-supplier=Onlinecomponents.com
U3 U4 U6 U7 U9 = U-MCP6071T-E/OT: Operational Amplifier, 1 Func, 150uV Offset-Max, CMOS, PDSO5; Manufacturer: Microchip; Package Body Material: Plastic; Architecture: VOLTAGE-FEEDBACK; Average Bias Current-Max (IIB): 5nA; Bias Current-Max (IIB) @25C: 100pA; Common-mode Reject Ratio-Nom: 91dB; Frequency Compensation: YES; Number of Functions: 1; Package Equivalence Code: TSOP5/6,.11,37; Power Supplies: 2.5V; Slew Rate: 0.5V/µs; Max Supply Current: 170uA; Supply Voltage Limit-Max: 7V; Supply Voltage-Nom (Vsup): 3V; Time @ Peak Reflow Temperature-Max (s): 40s; Unity Gain BW-Nom: 1.2MHz; Voltage Gain-Min: 56200; Power: No; Qualification Status: Not Qualified; Supplier 1: Avnet; Supplier Part Number 1: 23T2818; Manufacturer Part Number: MCP6071T-E/OT; RoHS: Yes; Category: Amplifiers - Op Amps, Buffer, Instrumentation; Stock: 6; Pricing: 1=0.648 (USD); Package Code: LSSOP; Number of Pins: 5; Package Shape: Rectangular; Terminal Finish: Tin; Min Operating Temperature: -40°C; Max Operating Temperature: 125°C; JESD-609 Code: e3; Amplifier Type: OPERATIONAL AMPLIFIER; Input Offset Voltage-Max: 150uV; JESD-30 Code: R-PDSO-G5; Low-Bias: Yes; Low-Offset: Yes; Micropower: Yes; Moisture Sensitivity Level: 1; Package Style: SMALL OUTLINE, LOW PROFILE, SHRINK PITCHMeter; Packaging: Tape and Reel; Peak Reflow Temperature (Cel): 260°C; Surface Mount: Yes; Technology: CMOS; Terminal Form: Gull Wing; Terminal Position: DUAL; Programmable Power: No; Wideband: No; Length: 2.9mm; Width: 1.55mm; Height - Seated (Max): 1.45mm; Terminal Pitch: 0.95mm; Temperature Grade: AUTOMOTIVE; Reach SVHC Compliant: Yes; RoHS Compliant: Yes; ComponentLink1URL: https://datasheet.ciiva.com:443/pdfs/VipMasterIC/IC/MCHP/MCHPS03324/MCHPS03324-1.pdf?src-supplier=IHS+Markit; ComponentLink1Description: https://datasheet.ciiva.com:443/pdfs/VipMasterIC/IC/MCHP/MCHPS03324/MCHPS03324-1.pdf?src-supplier=IHS+Markit; ComponentLink2URL: https://datasheet.ciiva.com/4761/22142-b-mcp6071-52533-4761074.pdf?src-supplier=Mouser; ComponentLink2Description: https://datasheet.ciiva.com/4761/22142-b-mcp6071-52533-4761074.pdf?src-supplier=Mouser; ComponentLink3URL: https://datasheet.ciiva.com/8078/387987-8078837.pdf?src-supplier=Element14; ComponentLink3Description: https://datasheet.ciiva.com/8078/387987-8078837.pdf?src-supplier=Element14; ComponentLink4URL: https://datasheet.ciiva.com/1793/22142-b-mcp6071-1793444.pdf?src-supplier=Digikey; ComponentLink4Description: https://datasheet.ciiva.com/1793/22142-b-mcp6071-1793444.pdf?src-supplier=Digikey; ComponentLink5URL: https://datasheet.ciiva.com/1793/22142-b-mcp6071-1793445.pdf?src-supplier=Digikey; ComponentLink5Description: https://datasheet.ciiva.com/1793/22142-b-mcp6071-1793445.pdf?src-supplier=Digikey; ComponentLink6URL: https://datasheet.ciiva.com/1793/22142-b-mcp6071-1793446.pdf?src-supplier=Digikey; ComponentLink6Description: https://datasheet.ciiva.com/1793/22142-b-mcp6071-1793446.pdf?src-supplier=Digikey; ComponentLink7URL: https://datasheet.ciiva.com/16426/filehandler-aspxddocname-en540513-16426686.pdf?src-supplier=Future+Electronics; ComponentLink7Description: https://datasheet.ciiva.com/16426/filehandler-aspxddocname-en540513-16426686.pdf?src-supplier=Future+Electronics; ComponentLink8URL: https://datasheet.ciiva.com/26937/getdatasheetpartid-770193-26937739.pdf?src-supplier=Verical; ComponentLink8Description: https://datasheet.ciiva.com/26937/getdatasheetpartid-770193-26937739.pdf?src-supplier=Verical; ComponentLink9URL: https://datasheet.ciiva.com/22711/387987-22711943.pdf?src-supplier=Element14; ComponentLink9Description: https://datasheet.ciiva.com/22711/387987-22711943.pdf?src-supplier=Element14; ComponentLink10URL: https://datasheet.ciiva.com/28630/1062688-28630617.pdf?src-supplier=Element14; ComponentLink10Description: https://datasheet.ciiva.com/28630/1062688-28630617.pdf?src-supplier=Element14; ComponentLink11URL: https://datasheet.ciiva.com/14545/70048096-14545063.pdf?src-supplier=Allied+Electronics; ComponentLink11Description: https://datasheet.ciiva.com/14545/70048096-14545063.pdf?src-supplier=Allied+Electronics; ComponentLink12URL: https://datasheet.ciiva.com/41459/001084911-da-01-en-ic-opamp-r-r-mcp6071t-e-ot-sot-23-5-mcp-41459147.pdf?src-supplier=Conrad; ComponentLink12Description: https://datasheet.ciiva.com/41459/001084911-da-01-en-ic-opamp-r-r-mcp6071t-e-ot-sot-23-5-mcp-41459147.pdf?src-supplier=Conrad